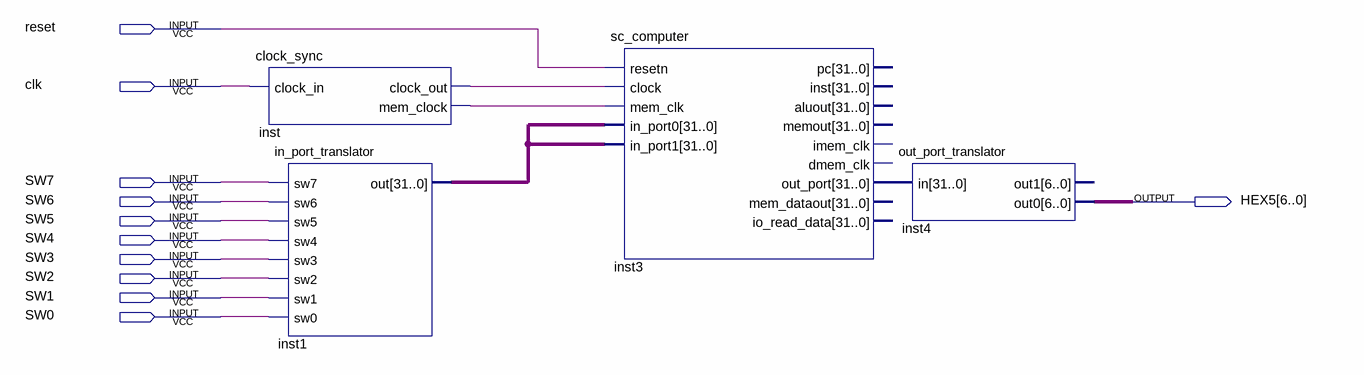
[diagram p0: schematic sheet]
// Quartus schematic program.bdf as structural Verilog: 4 symbols, 11 pins
module \program  (
  input  reset,
  input  clk,
  input  SW7,
  input  SW6,
  input  SW5,
  input  SW4,
  input  SW3,
  input  SW2,
  input  SW1,
  input  SW0,
  output [6:0] HEX5
);

  wire inst_clock_out, inst_mem_clock;
  wire [31:0] inst1_out, inst3_out_port;

  clock_sync inst (.clock_in(clk), .clock_out(inst_clock_out), .mem_clock(inst_mem_clock));
  in_port_translator inst1 (
    .sw7(SW7), .sw6(SW6), .sw5(SW5), .sw4(SW4), .sw3(SW3), .sw2(SW2), .sw1(SW1), .sw0(SW0), .out(inst1_out));
  sc_computer inst3 (
    .resetn(reset), .clock(inst_clock_out), .mem_clk(inst_mem_clock), .in_port0(inst1_out),
    .in_port1(inst1_out), .out_port(inst3_out_port));  // open: pc, inst, aluout, memout, imem_clk, dmem_clk, mem_dataout, io_read_data
  out_port_translator inst4 (.in(inst3_out_port), .out0(HEX5));  // open: out1
endmodule
